# Altium schematic sheet Template_FPGA.SchDoc: Spartan 3E FPGA Dev Board
size Letter; DrawnBy: Mergon Pierre; Revision: 1.0; SheetNumber: 3; SheetTotal: 8
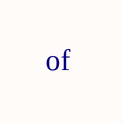
[diagram p0: Template_FPGA.SchDoc]

## Notes on the sheet
- of